# EAGLE design WA-ES_p1_twoside (EAGLE 9.5.0)
REV: p1; TITLE: Wizard-Architect's Experimental Substrate
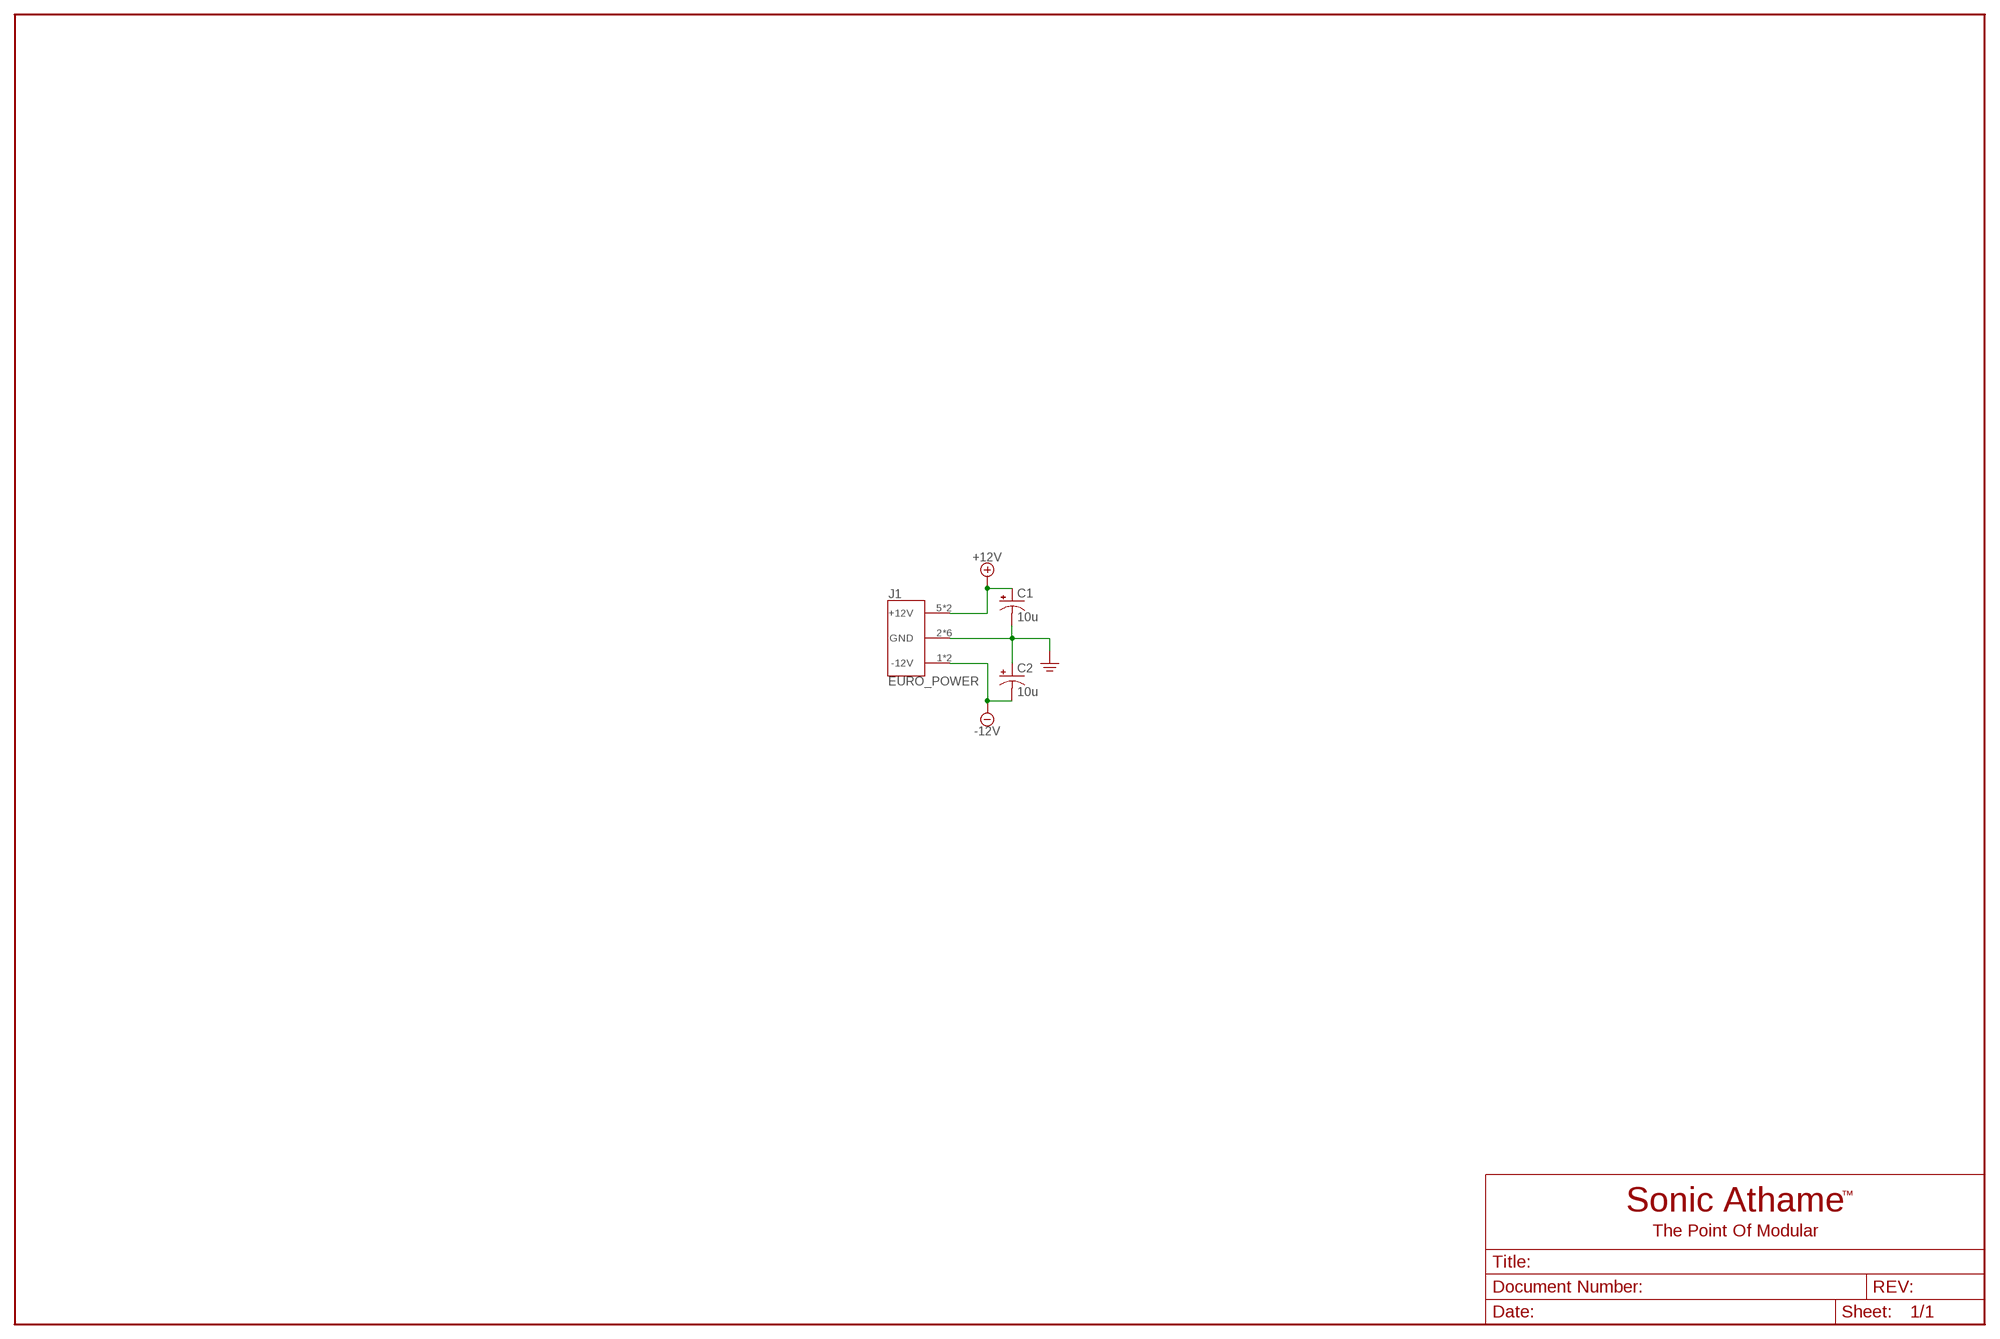
[diagram p0: schematic, sheet 1]

## Parts
C1  10u  CAP_POLLYTIC_V  [TT2D5]
C2  10u  CAP_POLLYTIC_V  [TT2D5]
J1  EURO_POWER  [EURO_POWER]

## Nets
+12V: C1.+ J1.5(+12V) J1.6(+12V)
-12V: C2.- J1.1(-12V) J1.10(-12V)
GND: C1.- C2.+ J1.2(GND) J1.3(GND) J1.4(GND) J1.7(GND) J1.8(GND) J1.9(GND)

## Library data of the parts
C1 C2 = SonicAthame:CAP_POL: POLARIZED CAPACITOR, American symbol
J1 = SonicAthame:EURO_POWER

## Board
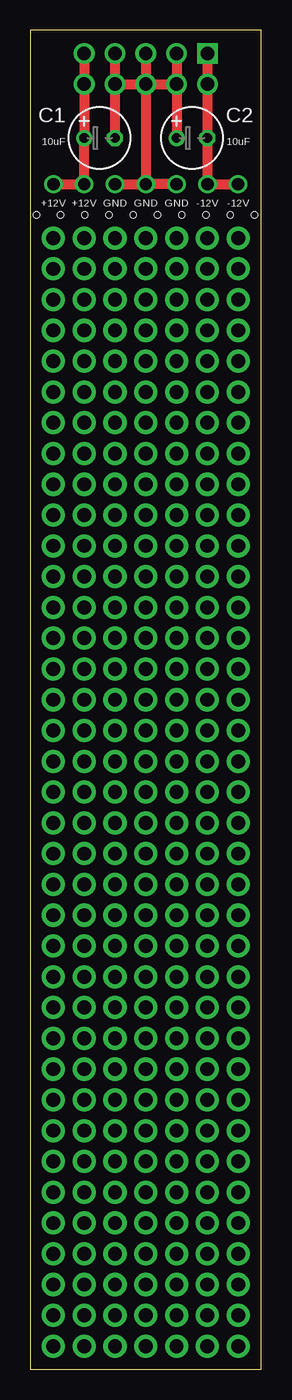
[diagram p1: board, top side]
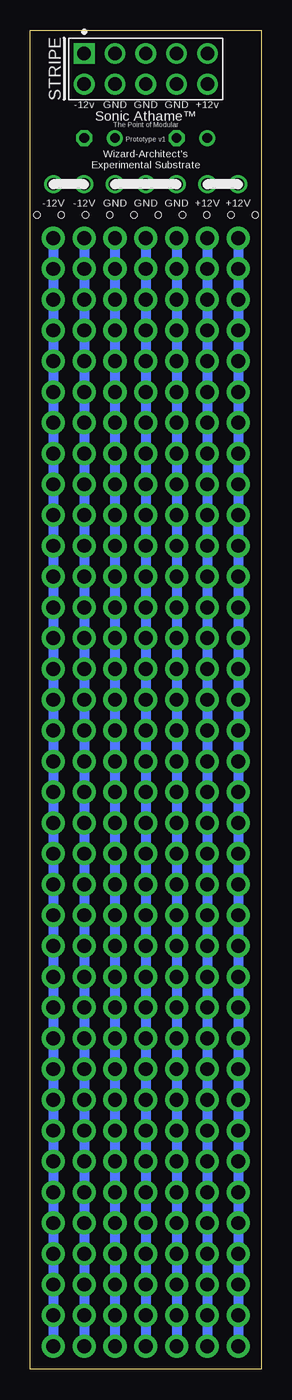
[diagram p2: board, bottom side, seen from below]

Size 19.05 x 110.49 mm. Coordinates in mm from the lower left corner, seen from the top.
Outline: 0,0 19.05,0 19.05,110.49 0,110.49 0,0
Copper layers (1*16): Top 0.035mm / dielectric 1.5mm / Bottom 0.035mm
Design rules "default *": minimum track width 6mil, minimum drill 0.35mm, track to track 6mil, track to pad 6mil, pad to pad 6mil, via to via 6mil, smd to smd 6mil, copper to edge 0.2mm, drill to drill 6mil, minimum pad ring 10mil, minimum via ring 8mil, stop-mask expansion 4mil, vias tented up to drill 0mil, thermal gap 10mil
Holes 0.5 mm at 0.5,95.25 2.5,95.25 4.5,95.25 6.5,95.25 8.5,95.25 10.5,95.25 12.5,95.25 14.5,95.25 16.5,95.25 18.5,95.25

### Footprints (pad centres in the part's own frame; a part is rotated, then mirrored left to right if it is on the bottom)
TT2D5 = drill 0.813: + -1.27,0 | drill 0.813 octagon: - 1.27,0
EURO_POWER = drill 1.105 pad 1.705 square: 1 -5.08,1.27 | drill 1.105 pad 1.705: 2 -2.54,1.27; 3 0,1.27; 4 2.54,1.27; 5 5.08,1.27; 6 5.08,-1.27; 7 2.54,-1.27; 8 0,-1.27; 9 -2.54,-1.27; 10 -5.08,-1.27

### Placement (x,y rotation side)
C1  5.71,101.6 0 top
C2  13.34,101.6 0 top
J1  9.53,107.31 0 bottom

### Tracks (layer width: path | path; a pad name or v marks a point on that pad's centre or on a via)
+12V  (via drill 1.02)
  Top 0.813: J1.5 J1.6 C1.+ v4.45,97.79 v1.91,97.79
-12V  (via drill 1.02)
  Top 0.813: J1.1 J1.10 C2.- v14.61,97.79 v17.14,97.79
GND  (via drill 1.02)
  Top 0.813: J1.4 J1.7 | J1.3 J1.8 | J1.2 J1.9 | J1.7 J1.8 | J1.8 J1.9 | J1.7 C1.- | J1.9 C2.+ | J1.8 v9.53,97.79 | v6.99,97.79 v9.53,97.79 | v12.06,97.79 v9.53,97.79
N$1  (via drill 1.14 pad 1.91)
  other vias: 4.45,93.34
N$2  (via drill 1.14 pad 1.91)
  other vias: 6.99,93.34
N$3  (via drill 1.14 pad 1.91)
  other vias: 9.53,93.34
N$4  (via drill 1.14 pad 1.91)
  other vias: 12.06,93.34
N$5  (via drill 1.14 pad 1.91)
  other vias: 14.61,93.34
N$6  (via drill 1.14 pad 1.91)
  other vias: 17.14,93.34
N$7  (via drill 1.14 pad 1.91)
  other vias: 1.91,90.81
N$8  (via drill 1.14 pad 1.91)
  Bottom 0.813: v1.91,93.34 v1.91,1.91
N$9  (via drill 1.14 pad 1.91)
  other vias: 4.45,90.81
N$10  (via drill 1.14 pad 1.91)
  other vias: 6.99,90.81
N$11  (via drill 1.14 pad 1.91)
  other vias: 9.53,90.81
N$12  (via drill 1.14 pad 1.91)
  other vias: 12.06,90.81
N$13  (via drill 1.14 pad 1.91)
  other vias: 14.61,90.81
N$14  (via drill 1.14 pad 1.91)
  other vias: 17.14,90.81
N$15  (via drill 1.14 pad 1.91)
  other vias: 1.91,88.27
N$16  (via drill 1.14 pad 1.91)
  other vias: 4.45,88.27
N$17  (via drill 1.14 pad 1.91)
  other vias: 6.99,88.27
N$18  (via drill 1.14 pad 1.91)
  other vias: 9.53,88.27
N$19  (via drill 1.14 pad 1.91)
  other vias: 12.06,88.27
N$20  (via drill 1.14 pad 1.91)
  other vias: 14.61,88.27
N$21  (via drill 1.14 pad 1.91)
  other vias: 17.14,88.27
N$22  (via drill 1.14 pad 1.91)
  other vias: 1.91,85.72
N$23  (via drill 1.14 pad 1.91)
  other vias: 4.45,85.72
N$24  (via drill 1.14 pad 1.91)
  other vias: 6.99,85.72
N$25  (via drill 1.14 pad 1.91)
  other vias: 9.53,85.72
N$26  (via drill 1.14 pad 1.91)
  other vias: 12.06,85.72
N$27  (via drill 1.14 pad 1.91)
  other vias: 14.61,85.72
N$28  (via drill 1.14 pad 1.91)
  other vias: 17.14,85.72
N$29  (via drill 1.14 pad 1.91)
  other vias: 1.91,83.19
N$30  (via drill 1.14 pad 1.91)
  other vias: 4.45,83.19
N$31  (via drill 1.14 pad 1.91)
  other vias: 6.99,83.19
N$32  (via drill 1.14 pad 1.91)
  other vias: 9.53,83.19
N$33  (via drill 1.14 pad 1.91)
  other vias: 12.06,83.19
N$34  (via drill 1.14 pad 1.91)
  other vias: 14.61,83.19
N$35  (via drill 1.14 pad 1.91)
  other vias: 17.14,83.19
N$36  (via drill 1.14 pad 1.91)
  other vias: 1.91,80.64
N$37  (via drill 1.14 pad 1.91)
  other vias: 4.45,80.64
N$38  (via drill 1.14 pad 1.91)
  other vias: 6.99,80.64
N$39  (via drill 1.14 pad 1.91)
  other vias: 9.53,80.64
N$40  (via drill 1.14 pad 1.91)
  other vias: 12.06,80.64
N$41  (via drill 1.14 pad 1.91)
  other vias: 14.61,80.64
N$42  (via drill 1.14 pad 1.91)
  other vias: 17.14,80.64
N$43  (via drill 1.14 pad 1.91)
  other vias: 1.91,78.11
N$44  (via drill 1.14 pad 1.91)
  other vias: 4.45,78.11
N$45  (via drill 1.14 pad 1.91)
  other vias: 6.99,78.11
N$46  (via drill 1.14 pad 1.91)
  other vias: 9.53,78.11
N$47  (via drill 1.14 pad 1.91)
  other vias: 12.06,78.11
N$48  (via drill 1.14 pad 1.91)
  other vias: 14.61,78.11
N$49  (via drill 1.14 pad 1.91)
  other vias: 17.14,78.11
N$50  (via drill 1.14 pad 1.91)
  other vias: 1.91,75.56
N$51  (via drill 1.14 pad 1.91)
  other vias: 4.45,75.56
N$52  (via drill 1.14 pad 1.91)
  other vias: 6.99,75.56
N$53  (via drill 1.14 pad 1.91)
  other vias: 9.53,75.56
N$54  (via drill 1.14 pad 1.91)
  other vias: 12.06,75.56
N$55  (via drill 1.14 pad 1.91)
  other vias: 14.61,75.56
N$56  (via drill 1.14 pad 1.91)
  other vias: 17.14,75.56
N$57  (via drill 1.14 pad 1.91)
  other vias: 1.91,73.03
N$58  (via drill 1.14 pad 1.91)
  other vias: 4.45,73.03
N$59  (via drill 1.14 pad 1.91)
  other vias: 6.99,73.03
N$60  (via drill 1.14 pad 1.91)
  other vias: 9.53,73.03
N$61  (via drill 1.14 pad 1.91)
  other vias: 12.06,73.03
N$62  (via drill 1.14 pad 1.91)
  other vias: 14.61,73.03
N$63  (via drill 1.14 pad 1.91)
  other vias: 17.14,73.03
N$64  (via drill 1.14 pad 1.91)
  other vias: 1.91,70.48
N$65  (via drill 1.14 pad 1.91)
  other vias: 4.45,70.48
N$66  (via drill 1.14 pad 1.91)
  other vias: 6.99,70.48
N$67  (via drill 1.14 pad 1.91)
  other vias: 9.53,70.48
N$68  (via drill 1.14 pad 1.91)
  other vias: 12.06,70.48
N$69  (via drill 1.14 pad 1.91)
  other vias: 14.61,70.48
N$70  (via drill 1.14 pad 1.91)
  other vias: 17.14,70.48
N$71  (via drill 1.14 pad 1.91)
  other vias: 1.91,67.94
N$72  (via drill 1.14 pad 1.91)
  other vias: 4.45,67.94
N$73  (via drill 1.14 pad 1.91)
  other vias: 6.99,67.94
N$74  (via drill 1.14 pad 1.91)
  other vias: 9.53,67.94
N$75  (via drill 1.14 pad 1.91)
  other vias: 12.06,67.94
N$76  (via drill 1.14 pad 1.91)
  other vias: 14.61,67.94
N$77  (via drill 1.14 pad 1.91)
  other vias: 17.14,67.94
N$78  (via drill 1.14 pad 1.91)
  other vias: 1.91,65.41
N$79  (via drill 1.14 pad 1.91)
  other vias: 4.45,65.41
N$80  (via drill 1.14 pad 1.91)
  other vias: 6.99,65.41
N$81  (via drill 1.14 pad 1.91)
  other vias: 9.53,65.41
N$82  (via drill 1.14 pad 1.91)
  other vias: 12.06,65.41
N$83  (via drill 1.14 pad 1.91)
  other vias: 14.61,65.41
N$84  (via drill 1.14 pad 1.91)
  other vias: 17.14,65.41
N$85  (via drill 1.14 pad 1.91)
  other vias: 1.91,62.87
N$86  (via drill 1.14 pad 1.91)
  other vias: 4.45,62.87
N$87  (via drill 1.14 pad 1.91)
  other vias: 6.99,62.87
N$88  (via drill 1.14 pad 1.91)
  other vias: 9.53,62.87
N$89  (via drill 1.14 pad 1.91)
  other vias: 12.06,62.87
N$90  (via drill 1.14 pad 1.91)
  other vias: 14.61,62.87
N$91  (via drill 1.14 pad 1.91)
  other vias: 17.14,62.87
N$92  (via drill 1.14 pad 1.91)
  other vias: 1.91,60.33
N$93  (via drill 1.14 pad 1.91)
  other vias: 4.45,60.33
N$94  (via drill 1.14 pad 1.91)
  other vias: 6.99,60.33
N$95  (via drill 1.14 pad 1.91)
  other vias: 9.53,60.33
N$96  (via drill 1.14 pad 1.91)
  other vias: 12.06,60.33
N$97  (via drill 1.14 pad 1.91)
  other vias: 14.61,60.33
N$98  (via drill 1.14 pad 1.91)
  other vias: 17.14,60.33
N$99  (via drill 1.14 pad 1.91)
  other vias: 1.91,57.78
N$100  (via drill 1.14 pad 1.91)
  other vias: 4.45,57.78
N$101  (via drill 1.14 pad 1.91)
  other vias: 6.99,57.78
N$102  (via drill 1.14 pad 1.91)
  other vias: 9.53,57.78
N$103  (via drill 1.14 pad 1.91)
  other vias: 12.06,57.78
N$104  (via drill 1.14 pad 1.91)
  other vias: 14.61,57.78
N$105  (via drill 1.14 pad 1.91)
  other vias: 17.14,57.78
N$106  (via drill 1.14 pad 1.91)
  other vias: 1.91,55.24
N$107  (via drill 1.14 pad 1.91)
  other vias: 4.45,55.24
N$108  (via drill 1.14 pad 1.91)
  other vias: 6.99,55.24
N$109  (via drill 1.14 pad 1.91)
  other vias: 9.53,55.24
N$110  (via drill 1.14 pad 1.91)
  other vias: 12.06,55.24
N$111  (via drill 1.14 pad 1.91)
  other vias: 14.61,55.24
N$112  (via drill 1.14 pad 1.91)
  other vias: 17.14,55.24
N$113  (via drill 1.14 pad 1.91)
  other vias: 1.91,52.7
N$114  (via drill 1.14 pad 1.91)
  other vias: 4.45,52.7
N$115  (via drill 1.14 pad 1.91)
  other vias: 6.99,52.7
N$116  (via drill 1.14 pad 1.91)
  other vias: 9.53,52.7
N$117  (via drill 1.14 pad 1.91)
  other vias: 12.06,52.7
N$118  (via drill 1.14 pad 1.91)
  other vias: 14.61,52.7
N$119  (via drill 1.14 pad 1.91)
  other vias: 17.14,52.7
N$120  (via drill 1.14 pad 1.91)
  other vias: 1.91,50.16
N$121  (via drill 1.14 pad 1.91)
  other vias: 4.45,50.16
N$122  (via drill 1.14 pad 1.91)
  other vias: 6.99,50.16
N$123  (via drill 1.14 pad 1.91)
  other vias: 9.53,50.16
N$124  (via drill 1.14 pad 1.91)
  other vias: 12.06,50.16
N$125  (via drill 1.14 pad 1.91)
  other vias: 14.61,50.16
N$126  (via drill 1.14 pad 1.91)
  other vias: 17.14,50.16
N$127  (via drill 1.14 pad 1.91)
  other vias: 1.91,47.62
N$128  (via drill 1.14 pad 1.91)
  other vias: 4.45,47.62
N$129  (via drill 1.14 pad 1.91)
  other vias: 6.99,47.62
N$130  (via drill 1.14 pad 1.91)
  other vias: 9.53,47.62
N$131  (via drill 1.14 pad 1.91)
  other vias: 12.06,47.62
N$132  (via drill 1.14 pad 1.91)
  other vias: 14.61,47.62
N$133  (via drill 1.14 pad 1.91)
  other vias: 17.14,47.62
N$134  (via drill 1.14 pad 1.91)
  other vias: 1.91,45.09
N$135  (via drill 1.14 pad 1.91)
  other vias: 4.45,45.09
N$136  (via drill 1.14 pad 1.91)
  other vias: 6.99,45.09
N$137  (via drill 1.14 pad 1.91)
  other vias: 9.53,45.09
N$138  (via drill 1.14 pad 1.91)
  other vias: 12.06,45.09
N$139  (via drill 1.14 pad 1.91)
  other vias: 14.61,45.09
N$140  (via drill 1.14 pad 1.91)
  other vias: 17.14,45.09
N$141  (via drill 1.14 pad 1.91)
  other vias: 1.91,42.55
N$142  (via drill 1.14 pad 1.91)
  other vias: 4.45,42.55
N$143  (via drill 1.14 pad 1.91)
  other vias: 6.99,42.55
N$144  (via drill 1.14 pad 1.91)
  other vias: 9.53,42.55
N$145  (via drill 1.14 pad 1.91)
  other vias: 12.06,42.55
N$146  (via drill 1.14 pad 1.91)
  other vias: 14.61,42.55
N$147  (via drill 1.14 pad 1.91)
  other vias: 17.14,42.55
N$148  (via drill 1.14 pad 1.91)
  other vias: 1.91,40.01
N$149  (via drill 1.14 pad 1.91)
  other vias: 4.45,40.01
N$150  (via drill 1.14 pad 1.91)
  other vias: 6.99,40.01
N$151  (via drill 1.14 pad 1.91)
  other vias: 9.53,40.01
N$152  (via drill 1.14 pad 1.91)
  other vias: 12.06,40.01
N$153  (via drill 1.14 pad 1.91)
  other vias: 14.61,40.01
N$154  (via drill 1.14 pad 1.91)
  other vias: 17.14,40.01
N$155  (via drill 1.14 pad 1.91)
  other vias: 1.91,37.47
N$156  (via drill 1.14 pad 1.91)
  other vias: 4.45,37.47
N$157  (via drill 1.14 pad 1.91)
  other vias: 6.99,37.47
N$158  (via drill 1.14 pad 1.91)
  other vias: 9.53,37.47
N$159  (via drill 1.14 pad 1.91)
  other vias: 12.06,37.47
N$160  (via drill 1.14 pad 1.91)
  other vias: 14.61,37.47
N$161  (via drill 1.14 pad 1.91)
  other vias: 17.14,37.47
N$162  (via drill 1.14 pad 1.91)
  other vias: 1.91,34.92
N$163  (via drill 1.14 pad 1.91)
  other vias: 4.45,34.92
N$164  (via drill 1.14 pad 1.91)
  other vias: 6.99,34.92
N$165  (via drill 1.14 pad 1.91)
  other vias: 9.53,34.92
N$166  (via drill 1.14 pad 1.91)
  other vias: 12.06,34.92
N$167  (via drill 1.14 pad 1.91)
  other vias: 14.61,34.92
N$168  (via drill 1.14 pad 1.91)
  other vias: 17.14,34.92
N$169  (via drill 1.14 pad 1.91)
  other vias: 1.91,32.38
N$170  (via drill 1.14 pad 1.91)
  other vias: 4.45,32.38
N$171  (via drill 1.14 pad 1.91)
  other vias: 6.99,32.38
N$172  (via drill 1.14 pad 1.91)
  other vias: 9.53,32.38
N$173  (via drill 1.14 pad 1.91)
  other vias: 12.06,32.38
N$174  (via drill 1.14 pad 1.91)
  other vias: 14.61,32.38
N$175  (via drill 1.14 pad 1.91)
  other vias: 17.14,32.38
N$176  (via drill 1.14 pad 1.91)
  other vias: 1.91,29.84
N$177  (via drill 1.14 pad 1.91)
  other vias: 4.45,29.84
N$178  (via drill 1.14 pad 1.91)
  other vias: 6.99,29.84
N$179  (via drill 1.14 pad 1.91)
  other vias: 9.53,29.84
N$180  (via drill 1.14 pad 1.91)
  other vias: 12.06,29.84
N$181  (via drill 1.14 pad 1.91)
  other vias: 14.61,29.84
N$182  (via drill 1.14 pad 1.91)
  other vias: 17.14,29.84
N$183  (via drill 1.14 pad 1.91)
  other vias: 1.91,27.3
N$184  (via drill 1.14 pad 1.91)
  other vias: 4.45,27.3
N$185  (via drill 1.14 pad 1.91)
  other vias: 6.99,27.3
N$186  (via drill 1.14 pad 1.91)
  other vias: 9.53,27.3
N$187  (via drill 1.14 pad 1.91)
  other vias: 12.06,27.3
N$188  (via drill 1.14 pad 1.91)
  other vias: 14.61,27.3
N$189  (via drill 1.14 pad 1.91)
  other vias: 17.14,27.3
N$190  (via drill 1.14 pad 1.91)
  other vias: 1.91,24.77
N$191  (via drill 1.14 pad 1.91)
  other vias: 4.45,24.77
N$192  (via drill 1.14 pad 1.91)
  other vias: 6.99,24.77
N$193  (via drill 1.14 pad 1.91)
  other vias: 9.53,24.77
N$194  (via drill 1.14 pad 1.91)
  other vias: 12.06,24.77
N$195  (via drill 1.14 pad 1.91)
  other vias: 14.61,24.77
N$196  (via drill 1.14 pad 1.91)
  other vias: 17.14,24.77
N$197  (via drill 1.14 pad 1.91)
  other vias: 1.91,22.23
N$198  (via drill 1.14 pad 1.91)
  other vias: 4.45,22.23
N$199  (via drill 1.14 pad 1.91)
  other vias: 6.99,22.23
N$200  (via drill 1.14 pad 1.91)
  other vias: 9.53,22.23
N$201  (via drill 1.14 pad 1.91)
  other vias: 12.06,22.23
N$202  (via drill 1.14 pad 1.91)
  other vias: 14.61,22.23
N$203  (via drill 1.14 pad 1.91)
  other vias: 17.14,22.23
N$204  (via drill 1.14 pad 1.91)
  other vias: 1.91,19.68
N$205  (via drill 1.14 pad 1.91)
  other vias: 4.45,19.68
N$206  (via drill 1.14 pad 1.91)
  other vias: 6.99,19.68
N$207  (via drill 1.14 pad 1.91)
  other vias: 9.53,19.68
N$208  (via drill 1.14 pad 1.91)
  other vias: 12.06,19.68
N$209  (via drill 1.14 pad 1.91)
  other vias: 14.61,19.68
N$210  (via drill 1.14 pad 1.91)
  other vias: 17.14,19.68
N$211  (via drill 1.14 pad 1.91)
  other vias: 1.91,17.14
N$212  (via drill 1.14 pad 1.91)
  other vias: 4.45,17.14
N$213  (via drill 1.14 pad 1.91)
  other vias: 6.99,17.14
N$214  (via drill 1.14 pad 1.91)
  other vias: 9.53,17.14
N$215  (via drill 1.14 pad 1.91)
  other vias: 12.06,17.14
N$216  (via drill 1.14 pad 1.91)
  other vias: 14.61,17.14
N$217  (via drill 1.14 pad 1.91)
  other vias: 17.14,17.14
N$218  (via drill 1.14 pad 1.91)
  other vias: 1.91,14.61
N$219  (via drill 1.14 pad 1.91)
  other vias: 4.45,14.61
N$220  (via drill 1.14 pad 1.91)
  other vias: 6.99,14.61
N$221  (via drill 1.14 pad 1.91)
  other vias: 9.53,14.61
N$222  (via drill 1.14 pad 1.91)
  other vias: 12.06,14.61
N$223  (via drill 1.14 pad 1.91)
  other vias: 14.61,14.61
N$224  (via drill 1.14 pad 1.91)
  other vias: 17.14,14.61
N$225  (via drill 1.14 pad 1.91)
  other vias: 1.91,12.06
N$226  (via drill 1.14 pad 1.91)
  other vias: 4.45,12.06
N$227  (via drill 1.14 pad 1.91)
  other vias: 6.99,12.06
N$228  (via drill 1.14 pad 1.91)
  other vias: 9.53,12.06
N$229  (via drill 1.14 pad 1.91)
  other vias: 12.06,12.06
N$230  (via drill 1.14 pad 1.91)
  other vias: 14.61,12.06
N$231  (via drill 1.14 pad 1.91)
  other vias: 17.14,12.06
N$232  (via drill 1.14 pad 1.91)
  other vias: 1.91,9.53
N$233  (via drill 1.14 pad 1.91)
  other vias: 4.45,9.53
N$234  (via drill 1.14 pad 1.91)
  other vias: 6.99,9.53
N$235  (via drill 1.14 pad 1.91)
  other vias: 9.53,9.53
N$236  (via drill 1.14 pad 1.91)
  other vias: 12.06,9.53
N$237  (via drill 1.14 pad 1.91)
  other vias: 14.61,9.53
N$238  (via drill 1.14 pad 1.91)
  other vias: 17.14,9.53
N$239  (via drill 1.14 pad 1.91)
  other vias: 1.91,6.99
N$240  (via drill 1.14 pad 1.91)
  other vias: 4.45,6.99
N$241  (via drill 1.14 pad 1.91)
  other vias: 6.99,6.99
N$242  (via drill 1.14 pad 1.91)
  other vias: 9.53,6.99
N$243  (via drill 1.14 pad 1.91)
  other vias: 12.06,6.99
N$244  (via drill 1.14 pad 1.91)
  other vias: 14.61,6.99
N$245  (via drill 1.14 pad 1.91)
  other vias: 17.14,6.99
N$246  (via drill 1.14 pad 1.91)
  other vias: 1.91,4.45
N$247  (via drill 1.14 pad 1.91)
  other vias: 4.45,4.45
N$248  (via drill 1.14 pad 1.91)
  other vias: 6.99,4.45
N$249  (via drill 1.14 pad 1.91)
  other vias: 9.53,4.45
N$250  (via drill 1.14 pad 1.91)
  other vias: 12.06,4.45
N$251  (via drill 1.14 pad 1.91)
  other vias: 14.61,4.45
N$252  (via drill 1.14 pad 1.91)
  other vias: 17.14,4.45
N$253
  Bottom 0.813: 4.45,93.34 4.45,1.91
N$254  (via drill 1.14 pad 1.91)
  other vias: 4.45,1.91
N$255  (via drill 1.14 pad 1.91)
  other vias: 6.99,1.91
N$256  (via drill 1.14 pad 1.91)
  other vias: 9.53,1.91
N$257  (via drill 1.14 pad 1.91)
  other vias: 12.06,1.91
N$258  (via drill 1.14 pad 1.91)
  other vias: 14.61,1.91
N$259  (via drill 1.14 pad 1.91)
  other vias: 17.14,1.91
N$260
  Bottom 0.813: 6.99,93.34 6.99,1.91
N$261
  Bottom 0.813: 9.53,93.34 9.53,1.91
N$262
  Bottom 0.813: 12.06,93.34 12.06,1.91
N$263
  Bottom 0.813: 14.61,93.34 14.61,1.91
N$264
  Bottom 0.813: 17.14,93.34 17.14,1.91

### Text on the board
tNames: 10uF | 10uF | +12V | +12V | GND | GND | GND | -12V | -12V
bNames: Sonic Athame™ | The Point of Modular | Prototype v1 | Wizard-Architect's / Experimental Substrate | +12V | +12V | GND | GND | GND | -12V | -12V